# Altium schematic sheet Power_Supply_1V8.SchDoc
size A4; CompanyName: Technische Hochschule Nürnberg Georg Simon Ohm; Organization: UltraZohm; Address1: Kesslerplatz 12; Address2: 90489 Nürnberg; Address3: GERMANY; SheetNumber: 30; SheetTotal: 36; Website: www.ultrazohm.com
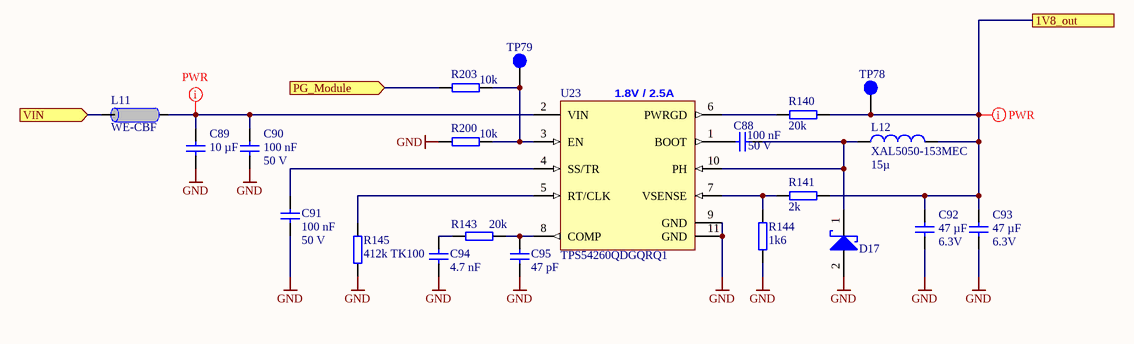
[diagram p0: Power_Supply_1V8.SchDoc]

## Parts
C88  100 nF  Voltage: 50 V  [C_0603_TE]
C89  10 µF  [C_1206_TE]
C90  100 nF  Voltage: 50 V  [C_0603_TE]
C91  100 nF  Voltage: 50 V  [C_0603_TE]
C92  47 µF  Voltage: 6.3V  [C_0805_TE]
C93  47 µF  Voltage: 6.3V  [C_0805_TE]
C94  4.7 nF  [C_0603_TE]
C95  47 pF  [C_0603_TE]
D17  STPS340UY  [SMB]  (value not drawn)
L11  WE-CBF  [INDC2012X92N_V]
L12  XAL5050-153MEC  value 15µ  [IND_XAL5050]
R140  20k  [R_0603_TE]
R141  2k  [R_0603_TE]
R143  20k  [R_0603_TE]
R144  1k6  [R_0603_TE]
R145  412k TK100  [R_0603_TE]
R200  10k  [R_0603_TE]
R203  10k  [R_0603_TE]
TP78  Testpoint 1mm  [TP_1mm]  (value not drawn)
TP79  Testpoint 1mm  [TP_1mm]  (value not drawn)
U23  TPS54260QDGQRQ1  [TSSOP50P490X110-11N-TI-DGQ]

## Ports
1V8_out, PG_Module (in), VIN (in)

## Nets
GND: C89.2 C90.1 C91.1 C92.1 C93.1 C94.2 C95.2 D17.2(A) R144.2 R145.2 R200.1 U23.9(GND) U23.11(GND)
1V8_out: C92.2 C93.2 L12.2 R140.1 R141.1 TP78.1 ; port 1V8_out
PG_Module: R203.1 ; port PG_Module
VIN: L11.2 ; port VIN
NetC88_1: C88.1 D17.1(K) L12.1 U23.10(PH)
NetC88_2: C88.2 U23.1(BOOT)
NetC89_1: C89.1 C90.2 L11.1 U23.2(VIN)
NetC91_2: C91.2 U23.4(SS/TR)
NetC94_1: C94.1 R143.2
NetC95_1: C95.1 R143.1 U23.8(COMP)
NetR140_2: R140.2 U23.6(PWRGD)
NetR141_2: R141.2 R144.1 U23.7(VSENSE)
NetR145_1: R145.1 U23.5(RT/CLK)
NetR200_2: R200.2 R203.2 TP79.1 U23.3(EN)

## Layout directives
net class PWR: 1V8_out, NetC89_1

## Notes on the sheet
- (near U23) 1.8V / 2.5A
- Title
- Revision:
- Design Engineer:
- Date:
- Project:
- Sheet
- of

## Library data of the parts
C88 C90 C91 = UZgen_C_0603_100nF_50V_X7R: Generic capacitor; Manufacturer: UZgen; Tolerance: 10 %; Created from: AGeiger; Value: 100 nF; Technology: X7R; Manufacturer Part Number: UZgen_C_0603_100nF_50V_X7R; PartID: 1; Created On: 02/07/2024 14:42:23; Device Package: 0603; Mounting Type: SMD; Last Updated: 02/08/2024 14:45:57
C89 = CL31B106KBHNNNE: 50V 10uF X7R ±10% 1206  Multilayer Ceramic Capacitors MLCC - SMD/SMT ROHS; Manufacturer: Samsung Electro-Mechanics; Voltage Rating: 50 VDC; Created from: AGeiger; Value: 10 µF; Tolerance: 10 %; Manufacturer Part Number: CL31B106KBHNNNE; PartID: 107; Created On: 20/09/2022 20:14:50; ComponentLink1Description: Datasheet; ComponentLink1URL: https://datasheet.lcsc.com/lcsc/1810221111_Samsung-Electro-Mechanics-CL31B106KBHNNNE_C89632.pdf; Component Type: Capacitor 1206; Device Package: 1206; Last Updated: 02/08/2024 15:35:49; Mounting Type: SMD; Operating Temperature: -55 - 125°C; Series: X7R; Supplier 1: LCSC; Supplier Part Number 1: C89632; Type: Capacitor; Live Cycle Status: 1; LCSC Part Number: C89632
C92 C93 = UZgen_C_0805_47uF_6.3V_X7R: Generic capacitor; Manufacturer: UZgen; Tolerance: 10 %; Created from: UZgenTool; Value: 47 µF; Technology: X7R; Manufacturer Part Number: UZgen_C_0805_47uF_6.3V_X7R; PartID: 5223; Created On: 02/08/2024 11:18:30; Device Package: 0805; Mounting Type: SMD; Last Updated: 02/08/2024 11:18:30
C94 = GRM1885C1H472JA01D: 50V 4.7nF C0G ±5% 0603 Multilayer Ceramic Capacitors MLCC; Manufacturer: Murata Electronics; Created from: MGeier; Tolerance: 5%; Value: 4.7 nF; Manufacturer Part Number: GRM1885C1H472JA01D; PartID: 153; Created On: 02/08/2024 16:00:00; ComponentLink1Description: Datasheet; ComponentLink1URL: https://wmsc.lcsc.com/wmsc/upload/file/pdf/v2/lcsc/2304140030_Murata-Electronics-GRM1885C1H472JA01D_C85980.pdf; Component Type: Capacitor 0603; Device Package: 0603; Last Updated: 02/08/2024 16:00:00; Mounting Type: SMD; Operating Temperature: –55 to 125°C; Series: GRM (Chip Multilayer Ceramic Capacitors for General Purpose); Supplier 1: LCSC; Supplier Part Number 1: C85980; Type: Capacitor; Voltage Rating: 50 V; Live Cycle Status: 1; LCSC Part Number: C85980; Stock number: not stored
C95 = CL10C470JB8NNNC: 50V 47pF C0G ±5% 0603 Multilayer Ceramic Capacitors MLCC; Manufacturer: Samsung Electro-Mechanics; Created from: MGeier; Tolerance: 5%; Value: 47 pF; Manufacturer Part Number: CL10C470JB8NNNC; PartID: 154; Created On: 02/08/2024 16:00:00; ComponentLink1Description: Datasheet; ComponentLink1URL: https://wmsc.lcsc.com/wmsc/upload/file/pdf/v2/lcsc/2304140030_Samsung-Electro-Mechanics-CL10C470JB8NNNC_C1671.pdf; Component Type: Capacitor 0603; Device Package: 0603; Last Updated: 02/08/2024 16:00:00; Mounting Type: SMD; Operating Temperature: –55 to 125°C; Series: CL; Supplier 1: LCSC; Supplier Part Number 1: C1671; Type: Capacitor; Voltage Rating: 50 V; Live Cycle Status: 1; LCSC Part Number: C1671; Stock number: not stored
D17 = STPS340UY: Power Schottky Rectifier, 3 A, 40 V, 0.57 µF; Manufacturer: STMicroelectronics; Forward Current: 3 A; Forward Voltage: 0.84 V; Reverse Current: 10 mA; Created from: MGremer; Manufacturer Part Number: STPS340UY; PartID: 1; Created On: 06.01.2021 14:34:10; ComponentLink1Description: Datasheet; ComponentLink1URL: https://www.mouser.de/datasheet/2/389/stps340_y-1851750.pdf; Component Type: Power Schottky Rectifier; Device Package: SMB; Last Updated: 15.02.2021 09:42:48; Mounting Type: SMD; Operating Temperature: -40 - 150 °C; Series: STPS340-Y; Supplier 1: Mouser; Supplier Part Number 1: 511-STPS340UY; Type: Power Schottky Rectifier; Value: -; Live Cycle Status: 1; Stock number: not stored
L11 = 24513: Ferritdurchführung SMD 0805; AN: 24513; Voltage: 2000mA; Mixed: SMT; Trenz-Stock: Yes; H-ART: 742792040; Extra: 0,15 Ohm DC, 600 Ohm bei 100MHz, 700 Ohm bei 150Mhz, 2000mA; Case: 2012 (0805); Technology: 0.15Ohm; HelpURL: B:\AD\adlib\datasheet\742792040
L12 = 26235: Power Inductor 15µH 20% 3.9A 76.7mOhms; AN: 26235; Mixed: SMT; Voltage: 3.9A 76.7mOhms; HelpURL: B:\AD\adlib\datasheet\xal50xx; H-ART: XAL5050-153MEC; Extra: XAL5050-153MEC
R140 R143 = UZgen_R_0603_20k: Generic resistor; Manufacturer: UZgen; Tolerance: 1 %; Created from: UZgenTool; Value: 20k; Manufacturer Part Number: UZgen_R_0603_20k; PartID: 251; Created On: 02.07.2024 17:29:50; Device Package: 0603; Mounting Type: SMD; Last Updated: 02.07.2024 17:29:50
R141 = UZgen_R_0603_2k: Generic resistor; Manufacturer: UZgen; Tolerance: 1 %; Created from: UZgenTool; Value: 2k; Manufacturer Part Number: UZgen_R_0603_2k; PartID: 228; Created On: 02.07.2024 17:29:49; Device Package: 0603; Mounting Type: SMD; Last Updated: 02.07.2024 17:29:49
R144 = UZgen_R_0603_1k6: Generic resistor; Manufacturer: UZgen; Tolerance: 1 %; Created from: UZgenTool; Value: 1k6; Manufacturer Part Number: UZgen_R_0603_1k6; PartID: 226; Created On: 02.07.2024 17:29:49; Device Package: 0603; Mounting Type: SMD; Last Updated: 02.07.2024 17:29:49
R145 = UZgen_R_0603_412k: Non generic resistor; Manufacturer: UZgen; Tolerance: 1 %; Created from: UZgenTool; Value: 412k TK100; Manufacturer Part Number: UZgen_R_0603_412k; PartID: 585; Created On: 08.07.2024 14:34:30; Device Package: 0603; Mounting Type: SMD; Last Updated: 10.07.2024 12:46:24
R200 R203 = UZgen_R_0603_10k: Generic resistor; Manufacturer: UZgen; Tolerance: 1 %; Created from: AGeiger; Value: 10k; Manufacturer Part Number: UZgen_R_0603_10k; PartID: 1; Created On: 02.07.2024 14:34:53; Device Package: 0603; Mounting Type: SMD; Last Updated: 02.07.2024 14:37:16
TP78 TP79 = 25063: AN: 25063; Mixed: SMT
U23 = TPS54260QDGQRQ1: Switching Voltage Regulators 3.5-42Vin,2.5A,2.5 MHz Step-Down Cnvrtr; Manufacturer: Texas Instruments; Created from: FRosner; Manufacturer Part Number: TPS54260QDGQRQ1; PartID: 5; Created On: 19.06.2024 15:45:41; ComponentLink1Description: Datasheet; ComponentLink1URL: https://www.ti.com/lit/ds/symlink/tps54260-q1.pdf?ts=1718807277251&ref_url=https%253A%252F%252Fwww.mouser.de%252F; Component Type: DC-DC Converters ROHS; Last Updated: 19.06.2024 15:45:41; Mounting Type: SMD; Operating Temperature: -40 - 125 °C; Supplier 1: Mouser; Supplier Part Number 1: 595-TPS54260QDGQRQ1; Supplier 2: LCSC; Supplier Part Number 2: C181278; Type: Switching Regulator; Live Cycle Status: 1; LCSC Part Number: C181278; Stock number: not stored